# EAGLE design Bus-Pirate-v3-Breakout (EAGLE 6.2)
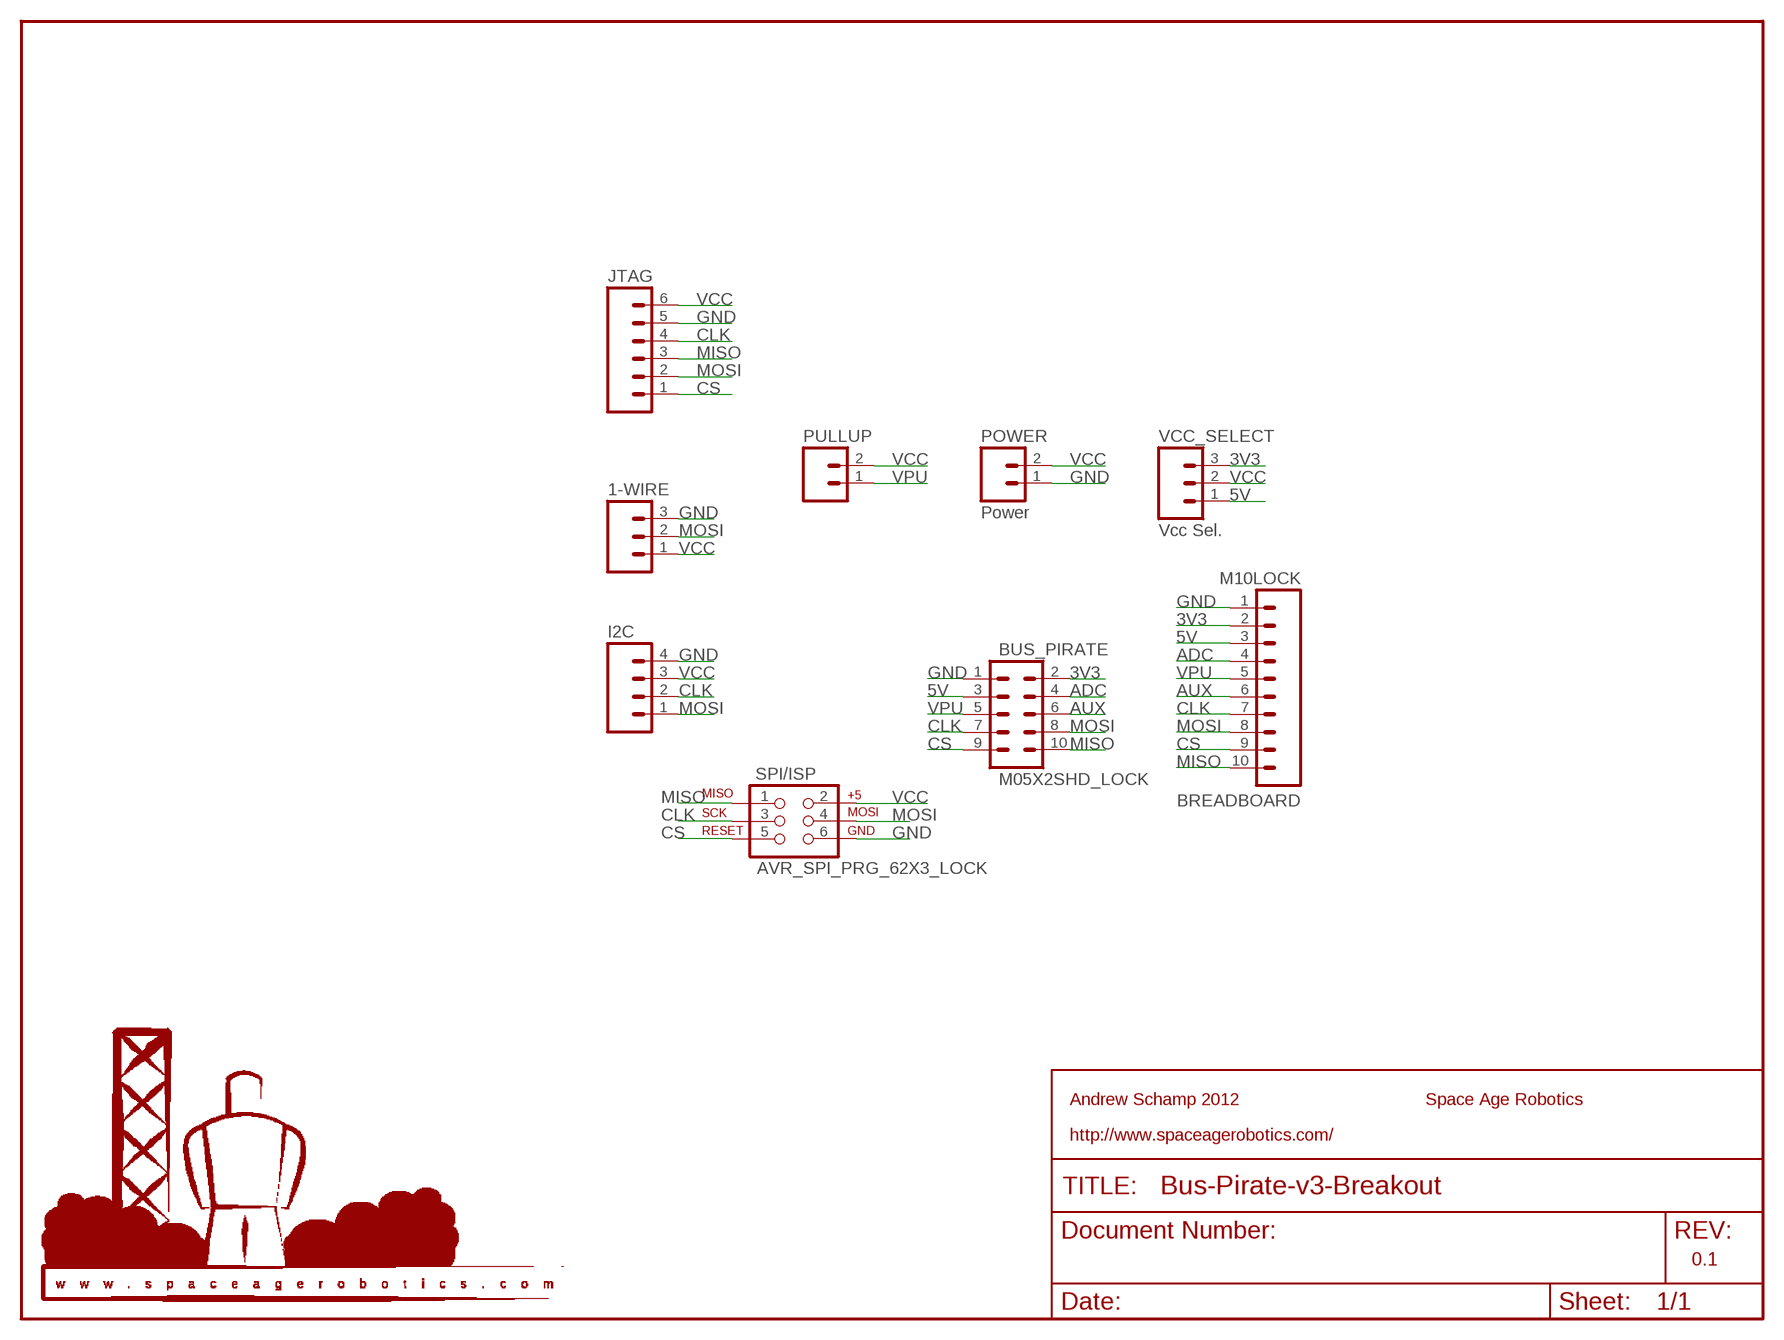
[diagram p0: schematic, sheet 1]

## Parts
1-WIRE  M03LOCK  [1X03_LOCK]
BREADBOARD  M10LOCK  [1X10_LOCK]
BUS_PIRATE  M05X2SHD_LOCK  [2X5-LOCK]
I2C  M04LOCK  [1X04_LOCK]
JTAG  M06LOCK  [1X06_LOCK]
POWER  Power  M02LOCK  [1X02_LOCK]
PULLUP  M02LOCK  [1X02_LOCK]
SPI/ISP  AVR_SPI_PRG_62X3_LOCK  [2X3_LOCK]
U$2  LOGO_SPACE_AGE_ROBOTICS0.48*0.27  [LOGO_SPACE_AGE_ROBOTICS_SMALL_0.48X0.27]
VCC_SELECT  Vcc Sel.  M03LOCK  [1X03_LOCK]

## Nets
3V3: BREADBOARD.2 BUS_PIRATE.2 VCC_SELECT.3
5V: BREADBOARD.3 BUS_PIRATE.3 VCC_SELECT.1
ADC: BREADBOARD.4 BUS_PIRATE.4
AUX: BREADBOARD.6 BUS_PIRATE.6
CLK: BREADBOARD.7 BUS_PIRATE.7 I2C.2 JTAG.4 SPI/ISP.3
CS: BREADBOARD.9 BUS_PIRATE.9 JTAG.1 SPI/ISP.5
GND: 1-WIRE.3 BREADBOARD.1 BUS_PIRATE.1 I2C.4 JTAG.5 POWER.1 SPI/ISP.6
MISO: BREADBOARD.10 BUS_PIRATE.10 JTAG.3 SPI/ISP.1
MOSI: 1-WIRE.2 BREADBOARD.8 BUS_PIRATE.8 I2C.1 JTAG.2 SPI/ISP.4
VCC: 1-WIRE.1 I2C.3 JTAG.6 POWER.2 PULLUP.2 SPI/ISP.2 VCC_SELECT.2
VPU: BREADBOARD.5 BUS_PIRATE.5 PULLUP.1

## Notes on the sheet
- Andrew Schamp 2012 | Space Age Robotics
- http://www.spaceagerobotics.com/
- 0.1

## Library data of the parts
1-WIRE VCC_SELECT = SparkFun:M03: Header 3 Standard 3-pin 0.1" header. Use with straight break away headers (SKU : PRT-00116), right angle break away headers (PRT-00553), swiss pins (PRT-00743), machine pins (PRT-00117), and female headers (PRT-00115). Molex polarized connector foot print use with SKU : PRT-08232 with associated crimp pins and housings.
BREADBOARD = SparkFun:M10: Header 10 Standard 10-pin 0.1" header. Use with straight break away headers (SKU : PRT-00116), right angle break away headers (PRT-00553), swiss pins (PRT-00743), machine pins (PRT-00117), and female headers (PRT-00115).
BUS_PIRATE = ideabot:M05X2: Header 5x2 Standard 10-pin dual row 0.1" header. Commonly used with AVR-ISP. Use with Spark Fun Electronics SKU: PRT-00778
I2C = SparkFun:M04: Header 4 Standard 4-pin 0.1" header. Use with straight break away headers (SKU : PRT-00116), right angle break away headers (PRT-00553), swiss pins (PRT-00743), machine pins (PRT-00117), and female headers (PRT-00115). Molex polarized connector foot print use with SKU : PRT-08231 with associated crimp pins and housings.
JTAG = SparkFun-Connectors:M06: Header 6 Standard 6-pin 0.1" header. Use with straight break away headers (SKU : PRT-00116), right angle break away headers (PRT-00553), swiss pins (PRT-00743), machine pins (PRT-00117), and female headers (PRT-00115). Molex polarized connector foot print use with SKU : PRT-08094 with associated crimp pins and housings. NOTES ON THE VARIANTS LOCK and LOCK_LONGPADS... This footprint was designed to help hold the alignment of a through-hole component (i.e. 6-pin header) while soldering it into place. You may notice that each hole has been shifted either up or down by 0.005 of an inch from it's more standard position (which is a perfectly straight line). This slight alteration caused the pins (the squares in the middle) to touch the edges of the holes. Because they are alternating, it causes a "brace" to hold the component in place. 0.005 has proven to be the perfect amount of "off-center" position when using our standard breakaway headers. Although looks a little odd when you look at the bare footprint, once you have a header in there, the alteration is very hard to notice. Also, if you push a header all the way into place, it is covered up entirely on the bottom side. This idea of altering the position of holes to aid alignment will be further integrated into the Sparkfun Library for other footprints. It can help hold any component with 3 or more connection pins.
POWER PULLUP = SparkFun:M02: Header 2 Standard 2-pin 0.1" header. Use with straight break away headers (SKU : PRT-00116), right angle break away headers (PRT-00553), swiss pins (PRT-00743), machine pins (PRT-00117), and female headers (PRT-00115). Molex polarized connector foot print use with SKU : PRT-08233 with associated crimp pins and housings.
SPI/ISP = SparkFun:AVR_SPI_PRG_6: AVR ISP 6 Pin This is the reduced ISP connector for AVR programming. Common on Arduino. This footprint will take up less PCB space and can be used with a 10-pin to 6-pin adapter such as SKU: BOB-08508
U$2 = logos:LOGO_SPACE_AGE_ROBOTICS

## Board
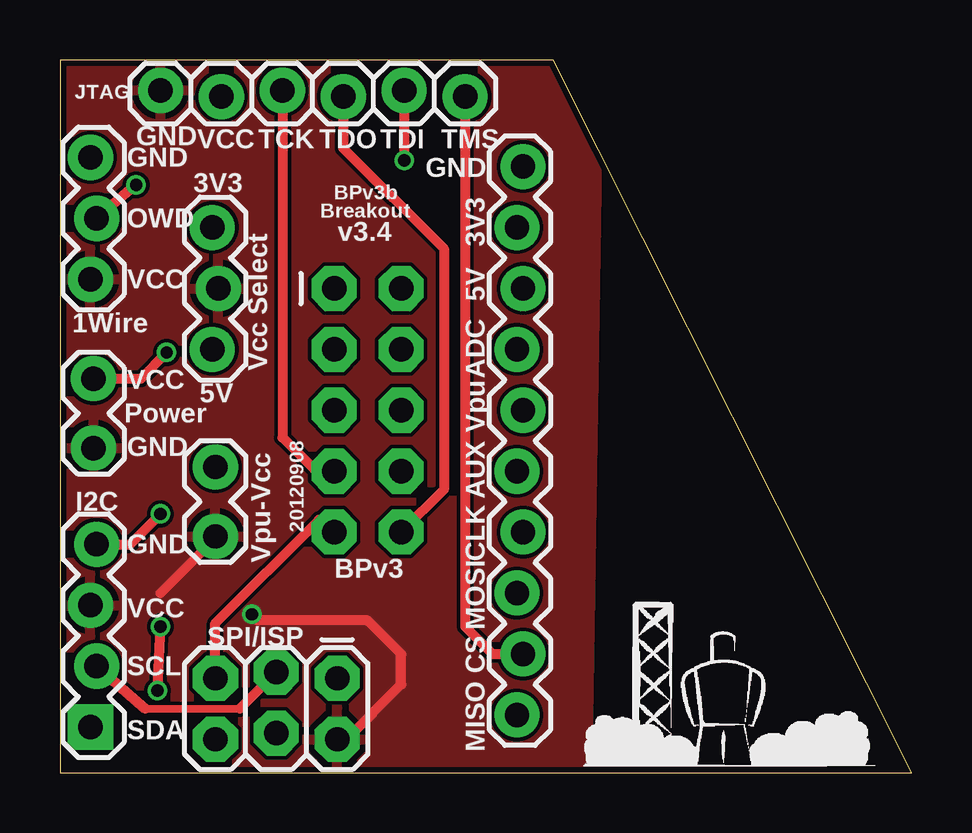
[diagram p1: board, top side]
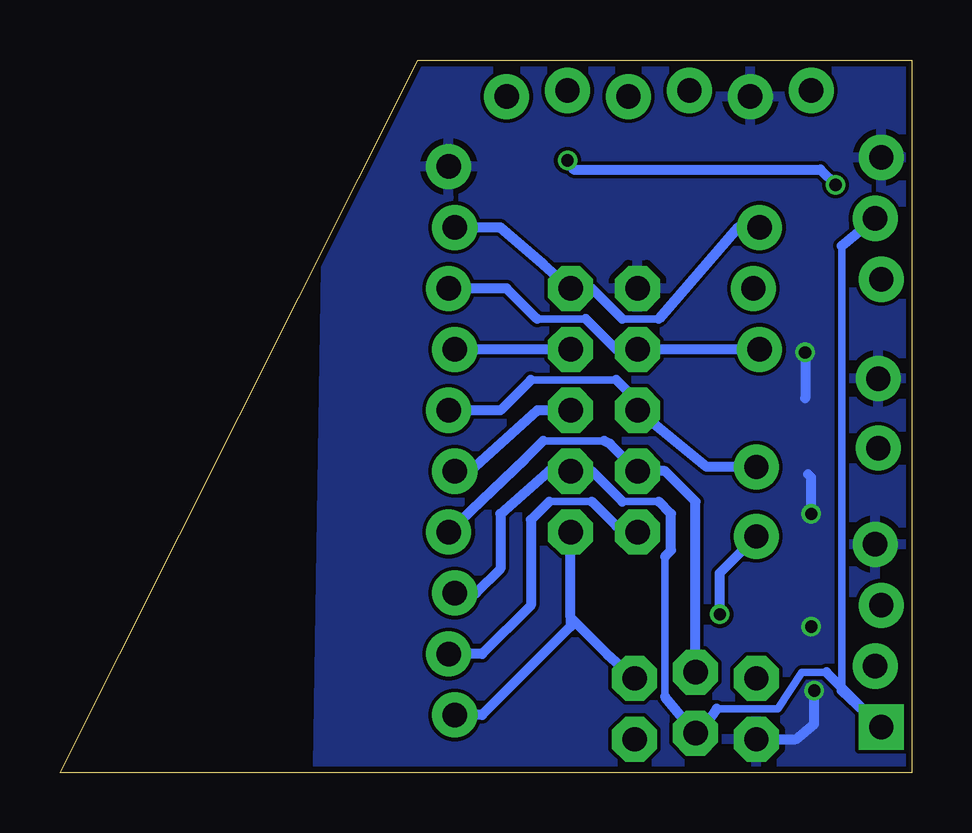
[diagram p2: board, bottom side, seen from below]

Size 35.51 x 29.72 mm. Coordinates in mm from the lower left corner, seen from the top.
Outline: 0,0 35.51,0 20.57,29.72 0,29.72 0,0
Copper layers (1*16): Top 0.035mm / dielectric 1.5mm / Bottom 0.035mm
Design rules: minimum track width 6mil, minimum drill 12mil, track to track 6mil, track to pad 6mil, pad to pad 6mil, via to via 6mil, smd to smd 0mil, copper to edge 10mil, drill to drill 10mil, minimum pad ring 10mil, minimum via ring 6mil, stop-mask expansion 2mil, vias tented up to drill 100mil, thermal gap 10mil

### Footprints (pad centres in the part's own frame; a part is rotated, then mirrored left to right if it is on the bottom)
1X03_LOCK = drill 1.016 pad 1.88: 1 0,0.127; 2 2.54,-0.127; 3 5.08,0.127
1X10_LOCK = drill 1.016 pad 1.88: 1 0,0.127; 2 2.54,-0.127; 3 5.08,0.127; 4 7.62,-0.127; 5 10.16,0.127; 6 12.7,-0.127; 7 15.24,0.127; 8 17.78,-0.127; 9 20.32,0.127; 10 22.86,-0.127
2X5-LOCK = drill 1.016 pad 1.88 octagon: 1 -1.397,5.08; 2 1.397,5.08; 3 -1.397,2.54; 4 1.397,2.54; 5 -1.397,0; 6 1.397,0; 7 -1.397,-2.54; 8 1.397,-2.54; 9 -1.397,-5.08; 10 1.397,-5.08
1X04_LOCK = drill 1.016 pad 1.88 square: 1 0,0.127 | drill 1.016 pad 1.88: 2 2.54,-0.127; 3 5.08,0.127; 4 7.62,-0.127
1X06_LOCK = drill 1.016 pad 1.88: 1 0,0; 2 2.54,-0.254; 3 5.08,0; 4 7.62,-0.254; 5 10.16,0; 6 12.7,-0.254
1X02_LOCK = drill 1.016 pad 1.88: 1 -0.178,0; 2 2.718,0
2X3_LOCK = drill 1.016 pad 1.88 octagon: 1 0,0; 2 0,2.54; 3 2.54,-0.254; 4 2.54,2.286; 5 5.08,0; 6 5.08,2.54

### Placement (x,y rotation side)
1-WIRE  1.4,20.57 90 top
BREADBOARD  19.18,25.27 270 top
BUS_PIRATE  12.83,15.11 0 top
I2C  1.4,1.91 90 top
JTAG  16.89,28.19 180 top
POWER  1.4,16.26 270 top
PULLUP  6.48,12.57 270 top
SPI/ISP  11.56,3.94 180 top
U$2  21.64,0.28 0 top
VCC_SELECT  6.48,17.65 90 top

### Tracks (layer width: path | path; a pad name or v marks a point on that pad's centre or on a via)
3V3
  Bottom 0.305: 10.54,18.92 12.06,18.92
  Bottom 0.406: BREADBOARD.2 17.14,22.73 15.37,21.21 BUS_PIRATE.2 13.34,20.19 12.06,18.92 | 10.54,18.92 7.24,22.73 VCC_SELECT.3
5V
  Bottom 0.305: 13.59,18.92 15.62,18.92
  Bottom 0.406: 13.59,18.92 12.32,17.65 BUS_PIRATE.3 VCC_SELECT.1 | 15.62,18.92 16.89,20.19 BREADBOARD.3
ADC
  Bottom 0.406: BUS_PIRATE.4 BREADBOARD.4
AUX
  Bottom 0.406: BUS_PIRATE.6 15.62,15.11 18.41,12.57 BREADBOARD.6
CLK
  Top 0.305: 3.56,2.67 7.49,2.67
  Top 0.406: 7.49,2.67 SPI/ISP.3 | I2C.2 3.56,2.67 | JTAG.4 9.27,13.97 10.67,12.57 BUS_PIRATE.7
  Bottom 0.305: 12.83,13.84 15.37,13.84
  Bottom 0.406: 15.37,13.84 16.13,13.08 BREADBOARD.7 | SPI/ISP.3 9.02,11.3 10.29,12.57 BUS_PIRATE.7 12.57,13.72 12.83,13.84
CS
  Top 0.406: BUS_PIRATE.9 10.79,10.54 6.48,6.22 SPI/ISP.5 | JTAG.1 16.89,6.1 18.03,4.95 BREADBOARD.9
  Bottom 0.305: 13.34,11.3 15.11,11.3
  Bottom 0.406: BUS_PIRATE.9 12.32,10.29 13.34,11.3 | 15.11,11.3 15.88,10.54 15.88,6.99 17.91,4.95 BREADBOARD.9
GND  (via drill 0.51)
  Top 0.406: I2C.4 2.92,9.53 v4.19,10.79 | POWER.1 3.38,16.43 v4.45,17.53 | v4.06,3.43 v4.19,6.1
  Bottom 0.406: v4.19,10.79 4.19,12.32 4.32,12.45 | v4.45,17.53 4.45,15.62 | SPI/ISP.6 4.83,1.4 4.06,2.03 v4.06,3.43
  pour Bottom: -1.65,31.88 -1.91,18.54 -0.64,0.76 -0.64,-1.02 24.77,-1.02 24.26,31.5
MISO
  Top 0.406: JTAG.3 11.81,26.04 16,21.84 16,11.81 BUS_PIRATE.10
  Bottom 0.406: 14.22,6.48 14.22,6.1 17.91,2.41 BREADBOARD.10 | 14.22,6.48 BUS_PIRATE.10 | SPI/ISP.1 12.7,4.95 14.22,6.48
MOSI  (via drill 0.51)
  Top 0.406: JTAG.2 v14.35,25.53 | v3.17,24.51 1-WIRE.2
  Bottom 0.305: 10.54,11.3 12.06,11.3 | 2.92,3.43 2.92,21.97 | 10.29,3.17 10.29,9.02 | 3.56,4.19 4.57,4.19 5.59,2.67 8.13,2.67
  Bottom 0.406: BREADBOARD.8 18.16,7.49 17.14,8.51 17.14,10.79 14.99,12.7 BUS_PIRATE.8 13.34,12.57 12.06,11.3 | 10.54,11.3 10.03,10.79 10.03,9.27 10.29,9.02 | 2.92,21.97 1-WIRE.2 | 2.92,3.43 I2C.1 3.56,4.19 | 10.29,3.17 SPI/ISP.4 9.02,1.4 8.13,2.67 | v14.35,25.53 14.1,25.15 3.81,25.15 v3.17,24.51
VCC  (via drill 0.51)
  Top 0.406: PULLUP.2 6.48,9.78 4.19,7.49 | SPI/ISP.2 11.94,1.4 14.22,3.68 14.22,4.95 12.83,6.35 8.26,6.35 v8,6.6
  Bottom 0.406: v8,6.6 8,8.33 PULLUP.2
  pour Top: -2.16,32.38 22.48,30.73 21.97,-0.38 -1.91,-0.89
VPU
  Bottom 0.305: 12.32,16.38 15.88,16.38
  Bottom 0.406: 12.32,16.38 11.56,15.62 BUS_PIRATE.5 8.56,12.75 PULLUP.1 | 15.88,16.38 17.14,15.11 BREADBOARD.5

### Text on the board
tNames: JTAG | GND | VCC | TCK | TDO | TDI | TMS | GND | GND | 3V3 | BPv3b | Breakout | 3V3 | OWD | v3.4 | 5V | VCC | 1Wire | ADC | Vcc Select | VCC | 5V | Vpu | Power | AUX | GND | I2C | CLK | 20120908 | GND | Vpu-Vcc | MOSI | BPv3 | VCC | SPI/ISP | CS | SCL | MISO | SDA